# Altium project PCB_Project.PrjPcb
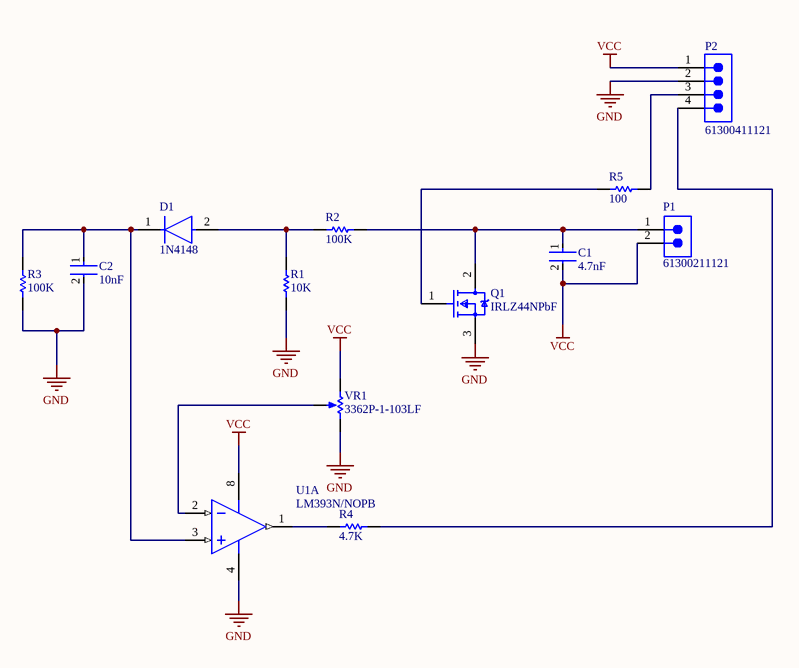
[diagram p0: Sheet1.SchDoc]
1 sheet, 13 parts. Net scope: global (net labels, ports and power ports of the same name join across sheets).
Board file: PCB1.PcbDoc

## Sheet Sheet1.SchDoc
size A; SheetNumber: 1; SheetTotal: 1

### Parts
C1  4.7nF  [FP-C320C-MFG]
C2  10nF  [FP-C320C-MFG]
D1  1N4148  [FP-017AG-MFG]
P1  61300211121  [61300211121]
P2  61300411121  [61300411121]
Q1  IRLZ44NPbF  [FP-PG-TO220-3-MFG]
R1  10K  [RESA60-630X240]
R2  100K  [RESA60-630X240]
R3  100K  [RESA60-630X240]
R4  4.7K  [RESA60-630X240]
R5  100  [RESA60-630X240]
U1  LM393N/NOPB  [P0008A]  (part A of 2)
VR1  3362P-1-103LF  [BOUR-3362P]

### Nets
GND: C2.2 P2.2 Q1.3(S) R1.1 R3.1 U1.4(GND) VR1.3(CW)
VCC: C1.2 P1.2 P2.1 U1.8(V+) VR1.1(CCW)
NetC1_1: C1.1 P1.1 Q1.2(D) R2.2
NetC2_1: C2.1 D1.1(C) R3.2 U1.3(INA+)
NetD1_2: D1.2(A) R1.2 R2.1
NetP2_3: P2.3 R5.2
NetP2_4: P2.4 R4.2
NetQ1_1: Q1.1(G) R5.1
NetR4_1: R4.1 U1.1(OUTA)
NetU1_2: U1.2(INA-) VR1.2(S)

### Library data of the parts
C1 C2 = CMP-03020-013948-1: CAP CER 0.1UF 50V X7R RADIAL; Manufacturer Part Number: C320C104J5R5TA7301; Manufacturer: KEMET; Tolerance: 5%; Material: Ceramic; Description: 0.1µF ±5% 50V Ceramic Capacitor X7R Radial; Temperature Coefficient: 15%; Temperature Range High: +125°C; Temperature: -55°C to +125°C; Temperature Characteristic: X7R; Height: 7.36mm; Automotive: No; Device Class L2: Capacitors; Package: C320C; Device Class L3: Ceramic Capacitors; Voltage Rating: 50V; Digikey Description: CAP CER 0.1UF 50V X7R RADIAL; Lead Free: Yes; Device Class L1: Passive Components; Octopart: https://octopart.com/c320c104j5r5ta7301-kemet-20072933; Temperature Range Low: -55°C; Mouser Description: Multilayer Ceramic Capacitors MLCC - Leaded 50volts 0.1uF 5% X7R; ComponentLink2Description: Datasheet; Category: Cap; ComponentLink2URL: https://content.kemet.com/datasheets/KEM_C1050_GOLDMAX_X7R.pdf; RoHS: TRUE
  C1: Capacitance: 4.7nF; Value: 4.7nF
  C2: Capacitance: 10nF; Value: 10nF
D1 = CMP-07163-000046-1: DIODE GEN PURP 100V 200MA DO35; Forward Voltage: 1V; Max Power Dissipation: 500mW; Max Reverse Current: 5uA; Forward Current: 300mA; Current: 4A; Reverse Recovery Time: 4ns; Element Configuration: Single; Outside Diameter: 1.85mm; Capacitance: 4pF; Polarity: Standard; Max Forward Surge Current (Ifsm): 1A; Reverse Voltage: 100V; Output Current: 200mA; Average Rectified Current: 200mA; Diameter: 1.91mm; Max Repetitive Reverse Voltage (Vrrm): 100V; Current Rating: 200mA; Case/Package: DO-35; Lead Free: Lead Free; Number of Pins: 2; Recovery Time: 4ns; Packaging: Bulk; Contact Plating: Tin; Voltage: 100V; Mount: Through Hole; Max Surge Current: 4A; Package Quantity: 2000; Width: 1.91mm; Max Reverse Voltage (DC): 100V; Length: 4.56mm; Radiation Hardening: No; Power Dissipation: 500mW; Voltage Rating (DC): 100V; Peak Non-Repetitive Surge Current: 4A; REACH SVHC: No SVHC; Height: 4.56mm; Max Operating Temperature: 175°C; Series: -; Weight: 0.01lb; Min Operating Temperature: -65°C
P1 = CMP-1712-00002-7: THT Vertical Pin Header WR-PHD, Pitch 2.54 mm, Single Row, 2 pins; Pitch: 2.54mm; Number of Contacts: 2; Connector Type: Male Pin; Gender: Male; Contact Resistance: 20mΩ; Operating Supply Voltage: 250V; Current Rating: 3A; Housing Material: PBT; RoHS: Compliant; Lead Free: Lead Free; Contact Material: Gold; REACH SVHC: No; Min Operating Temperature: -40°C; Termination: Through Hole; Number of Pins: 2; Contact Gender: Male; Packaging: Bulk; Lead Pitch: 2.54mm; Contact Plating: Gold; Orientation: Vertical; Mount: Through Hole; Height: 8.94mm; Color: Black; Number of Positions: 2; Contact Mating Length: 5.9944mm; Max Operating Temperature: 105°C; Voltage Rating: 250V; Number of Rows: 1
P2 = CMP-1502-01064-4: THT Vertical Pin Header WR-PHD, Pitch 2.54 mm, Single Row, 4 pins; Connector Type: Male Pin; Gender: Male; Current Rating: 3A; Number of Positions: 4; Operating Supply Voltage: 250V; Contact Resistance: 20mΩ; Pitch: 2.54mm; Max Operating Temperature: 105°C; Mount: Through Hole; Contact Material: Gold; Contact Plating: Gold; Number of Contacts: 4; Orientation: Vertical; Packaging: Bulk; Contact Mating Length: 5.9944mm; Voltage Rating: 250V; Number of Rows: 1; Height: 8.89mm; Lead Free: Lead Free; Lead Pitch: 2.54mm; Number of Pins: 4; Color: Black; Min Operating Temperature: -40°C; RoHS: Compliant; Termination: Solder
Q1 = CMP-32901-000488-1: MOSFET N-CH 55V 47A TO220AB; Turn-On Delay Time: 11ns; Gate to Source Voltage (Vgs): 16V; Element Configuration: Single; Rds On Max: 22mR; Turn-Off Delay Time: 26ns; Max Power Dissipation: 110W; Threshold Voltage: 2V; Drain to Source Resistance: 35mR; Input Capacitance: 1.7nF; Continuous Drain Current (ID): 47A; Case/Package: TO-220; Lead Free: Lead Free; Halogen Free: Halogen Free; Packaging: Rail/Tube; Length: 0.414inch; Min Operating Temperature: -55°C; REACH SVHC: No SVHC; Number of Pins: 3; Width: 0.185inch; Drain to Source Voltage (Vdss): 55V; Power Dissipation: 110W; RoHS Compliant: Yes; Max Operating Temperature: 175°C; Height: 0.6inch; Max Dual Supply Voltage: 55V; Drain to Source Breakdown Voltage: 55V; Mount: Through Hole
R1-R5 = CMP-1659-00073-1: Axial Resistor, 100 KOhm, +/- 1%, 0.25 W, -55 to 155 degC, 2-Pin THD, RoHS, Bulk; Voltage Rating: 250 V; Power Rating: 250 mW; PackageDescription: 2-Pin Axial Lead, Dia 2.4 mm, Body Length 6.3 mm; PackageReference: MFR-25; Length: 0.248 inch; ComponentLink2Description: Datasheet; Packaging: Bulk; DatasheetVersion: Apr-13; Package Quantity: 200; Min Operating Temperature: -55 degC; ComponentLink2URL: http://www.yageo.com/documents/recent/Yageo%20LR_MFR_2013.pdf; RoHSCompliant: true; ComponentLink1URL: http://www.yageo.com/; Tolerance: 1%; Case\Package: Axial; Mount: Through Hole; ComponentLink1Description: Manufacturer URL; Max Operating Temperature: 155 degC
  R1: Resistance: 10k
  R2 R3: Resistance: 100k
  R4: Resistance: 4.7k
  R5: Resistance: 100
U1 = CMP-0055-00118-3: Low Power Low Offset Voltage Dual Comparator, 8-pin MDIP, Pb-Free; Manufacturer: Texas Instruments; PackageTopMarking: NSUZXYTTE#*LM*393N; CompType: Amplifiers; PowerWise: N; PinCount: 8; RoHS: Y; PackageDescription: MDIP, .365 x .250 x .130in, 8 Lead, .100in Pitch; ComponentLink1URL: http://www.ti.com/general/docs/lit/getliterature.tsp?genericPartNumber=LM393-N&fileType=pdf; Code_JEDEC: MS-001-BA; ComponentLink1Description: Datasheet URL; Package Reference: P0008A
VR1 = CMP-1747-00004-1: Square Trimpot(R) Trimming Potentiometer, 10 KOhm, 300 V, -55 to 125 degC, 3-Pin THD, RoHS, Tube; Voltage Rating: 220 mV; Power Rating: 1 W; Tolerance: 1%; Resistance: 50 mohm; Case/Package: 1206; Length: 3.2 mm; RoHSCompliant: True; PackageDescription: 3-Pin Through Hole Device, Body 6.6 x 6.99 mm, Pitch 2.54 mm; ComponentLink2Description: Datasheet; REACH SVHC: No SVHC; Mount: Surface Mount; Height: 0.6 mm; Packaging: Tape and Reel; ComponentLink1URL: http://www.bourns.com/; Case Code (Imperial): 0612; Pins: 2; Case Code (Metric): 1632; ComponentLink2URL: http://www.bourns.com/docs/Product-Datasheets/3362.pdf; Min Operating Temperature: -25degC; ComponentLink1Description: Manufacturer URL; PackageReference: 3326P; Max Operating Temperature: 125degC; Width: 1.6 mm; Package Quantity: 5000; DatasheetVersion: May-16